# Altium project OrientationBoard_LIS303_LIS2DM_L3GD20.PrjPcb
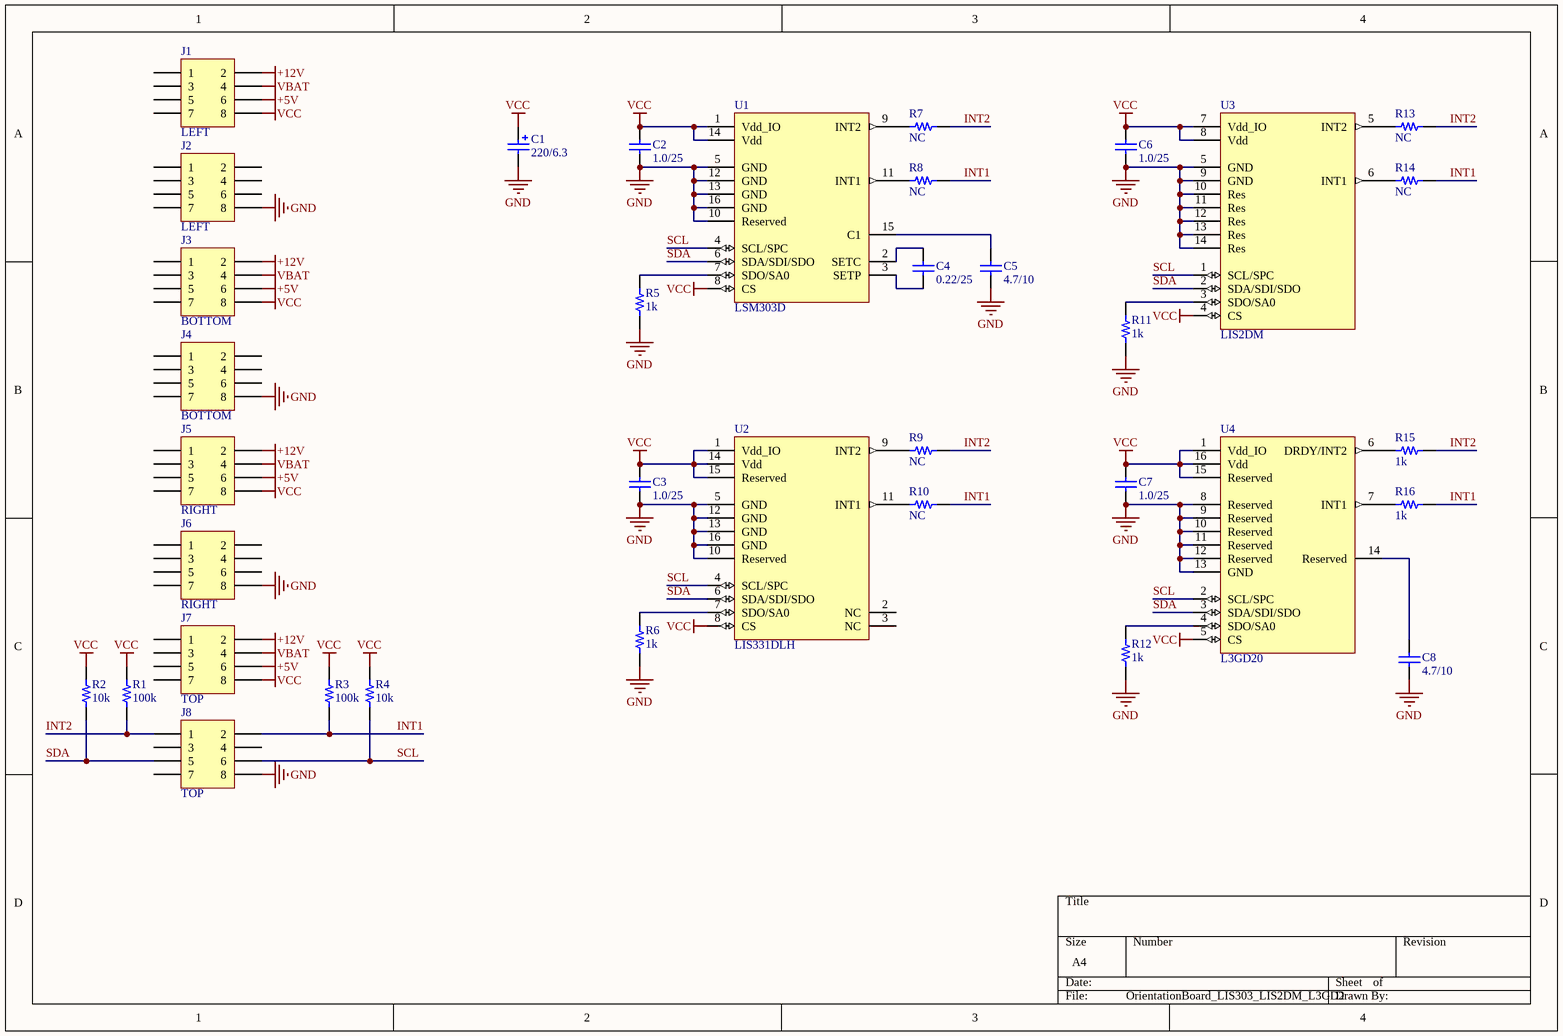
[diagram p0: OrientationBoard_LIS303_LIS2DM_L3GD20.SchDoc]
1 sheet, 36 parts. Net scope: global (net labels, ports and power ports of the same name join across sheets).
Board file: OrientationBoard_LIS303_LIS2DM_L3GD20.PcbDoc

## Sheet OrientationBoard_LIS303_LIS2DM_L3GD20.SchDoc
size A4

### Parts
C1  220/6.3  [SMC]
C2  1.0/25  [CAP0402]
C3  1.0/25  [CAP0402]
C4  0.22/25  [CAP0402]
C5  4.7/10  [CAP0603]
C6  1.0/25  [CAP0402]
C7  1.0/25  [CAP0402]
C8  4.7/10  [CAP0603]
J1  LEFT  [PBDM-8]
J2  LEFT  [PBDM-8]
J3  BOTTOM  [PBDM-8]
J4  BOTTOM  [PBDM-8]
J5  RIGHT  [PBDM-8]
J6  RIGHT  [PBDM-8]
J7  TOP  [PBDM-8]
J8  TOP  [PBDM-8]
R1  100k  [RES0402]
R2  10k  [RES0402]
R3  100k  [RES0402]
R4  10k  [RES0402]
R5  1k  [RES0402]
R6  1k  [RES0402]
R7  NC  [RES0402]
R8  NC  [RES0402]
R9  NC  [RES0402]
R10  NC  [RES0402]
R11  1k  [RES0402]
R12  1k  [RES0402]
R13  NC  [RES0402]
R14  NC  [RES0402]
R15  1k  [RES0402]
R16  1k  [RES0402]
U1  LSM303D  [LGA16(3x3x1)]
U2  LIS331DLH  [LGA16(3x3x1)]
U3  LIS2DM  [LGA14(2x2x1)]
U4  L3GD20  [LGA16(4x4x1)]

### Nets
+5V: J1.6 J3.6 J5.6 J7.6
+12V: J1.2 J3.2 J5.2 J7.2
GND: C1.1 C2.1 C3.1 C5.1 C6.1 C7.1 C8.1 J2.8 J4.8 J6.8 J8.8 R5.1 R6.1 R11.1 R12.1 U1.5(GND) U1.10(Reserved) U1.12(GND) U1.13(GND) U1.16(GND) U2.5(GND) U2.10(Reserved) U2.12(GND) U2.13(GND) U2.16(GND) U3.5(GND) U3.9(GND) U3.10(Res) U3.11(Res) U3.12(Res) U3.13(Res) U3.14(Res) U4.8(Reserved) U4.9(Reserved) U4.10(Reserved) U4.11(Reserved) U4.12(Reserved) U4.13(GND)
VBAT: J1.4 J3.4 J5.4 J7.4
VCC: C1.2 C2.2 C3.2 C6.2 C7.2 J1.8 J3.8 J5.8 J7.8 R1.2 R2.2 R3.2 R4.2 U1.1(Vdd_IO) U1.8(CS) U1.14(Vdd) U2.1(Vdd_IO) U2.8(CS) U2.14(Vdd) U2.15(Reserved) U3.4(CS) U3.7(Vdd_IO) U3.8(Vdd) U4.1(Vdd_IO) U4.5(CS) U4.15(Reserved) U4.16(Vdd)
INT1: J8.2 R3.1 R8.1 R10.1 R14.1 R16.1
INT2: J8.1 R1.1 R7.1 R9.1 R13.1 R15.1
SCL: J8.6 R4.1 U1.4(SCL/SPC) U2.4(SCL/SPC) U3.1(SCL/SPC) U4.2(SCL/SPC)
SDA: J8.5 R2.1 U1.6(SDA/SDI/SDO) U2.6(SDA/SDI/SDO) U3.2(SDA/SDI/SDO) U4.3(SDA/SDI/SDO)
NetC4_1: C4.1 U1.3(SETP)
NetC4_2: C4.2 U1.2(SETC)
NetC5_2: C5.2 U1.15(C1)
NetC8_2: C8.2 U4.14(Reserved)
NetR5_2: R5.2 U1.7(SDO/SA0)
NetR6_2: R6.2 U2.7(SDO/SA0)
NetR7_2: R7.2 U1.9(INT2)
NetR8_2: R8.2 U1.11(INT1)
NetR9_2: R9.2 U2.9(INT2)
NetR10_2: R10.2 U2.11(INT1)
NetR11_2: R11.2 U3.3(SDO/SA0)
NetR12_2: R12.2 U4.4(SDO/SA0)
NetR13_2: R13.2 U3.5(INT2)
NetR14_2: R14.2 U3.6(INT1)
NetR15_2: R15.2 U4.6(DRDY/INT2)
NetR16_2: R16.2 U4.7(INT1)

Not connected (* = marked no-connect by the designer): J1 1 3 5 7; J2 1 2 3 4 5 6 7; J3 1 3 5 7; J4 1 2 3 4 5 6 7; J5 1 3 5 7; J6 1 2 3 4 5 6 7; J7 1 3 5 7; J8 3 4 7; U2 2(NC) 3(NC)

### Library data of the parts
C1 = TAJC: Standard tantalum SMT capacitor, size C; PartNumber: TAJC; Value: 220; Voltage: 6.3; Category: Capacitor; ComponentLink1Description: Datasheet; ComponentLink1URL: d:\_AltiumLibs\Pdf\Passive\Capacitors\TAJ - AVX.pdf; Author: oiezhov
C2 C3 C6 C7 = CAP0402: Ceramic chip capacitor 0402; Value: 1.0; Voltage: 25; PartNumber: CAP0402; Category: Capacitor; Author: oiezhov
C4 = CAP0402: Ceramic chip capacitor 0402; Value: 0.22; Voltage: 25; PartNumber: CAP0402; Category: Capacitor; Author: oiezhov
C5 C8 = CAP0603: Ceramic chip capacitor 0603; Value: 4.7; Voltage: 10; PartNumber: CAP0603; Category: Capacitor; Author: oiezhov
J1-J8 = PBDM-8: 2x4-pin header, pitch 2.54 mm; PartNumber: PBDM-8; Category: Connector; ComponentLink1Description: Datasheet; ComponentLink1URL: d:\_AltiumLibs\Pdf\Mechanical\Connector\pbsm.pdf; Author: oiezhov
R1-R16 = RES0402: Ceramic chip resistor; PartNumber: RES0402; Category: Resistor; Author: oiezhov
  R1 R3: Value: 100k
  R2 R4: Value: 10k
  R5 R6 R11 R12 R15 R16: Value: 1k
  R7-R10 R13 R14: Value: NC
U1 = LSM303D: Ultra-compact high-performance eCompass module: 3D accelerometer and 3D magnetometer; PartNumber: LSM303D; Category: IC/Sensor; ComponentLink1Description: Datasheet; ComponentLink1URL: d:\_AltiumLibs\Pdf\IC\Sensors\LSM303D.pdf; Author: oiezhov
U2 = LIS331DLH: MEMS digital output motion sensor ultra low-power high performance 3-axes “nano” accelerometer; PartNumber: LIS331DLH; Category: IC/Sensor; ComponentLink1Description: Datasheet; ComponentLink1URL: d:\_AltiumLibs\Pdf\IC\Sensors\LIS331DLH.pdf; Author: oiezhov
U3 = LIS2DM: MEMS digital output motion sensor: ultra low-power high performance 3-axis “femto” accelerometer; PartNumber: LIS2DM; Category: IC/Sensor; ComponentLink1Description: Datasheet; ComponentLink1URL: d:\_AltiumLibs\Pdf\IC\Sensors\LIS2DM.pdf; Author: oiezhov
U4 = L3GD20: MEMS motion sensor: three-axis digital output gyroscope; PartNumber: L3GD20; Category: IC/Sensor; ComponentLink1Description: Datasheet; ComponentLink1URL: d:\_AltiumLibs\Pdf\IC\Sensors\L3GD20.pdf; Author: oiezhov